# Altium schematic sheet cm_filter_ch0_a.SchDoc: Common Mode Filter CH0 A
size A4; Date: 2015-02-21; Author: Piotr Kuligowski; Revision: 1-0; SheetNumber: 2; SheetTotal: 8; Model: EM1
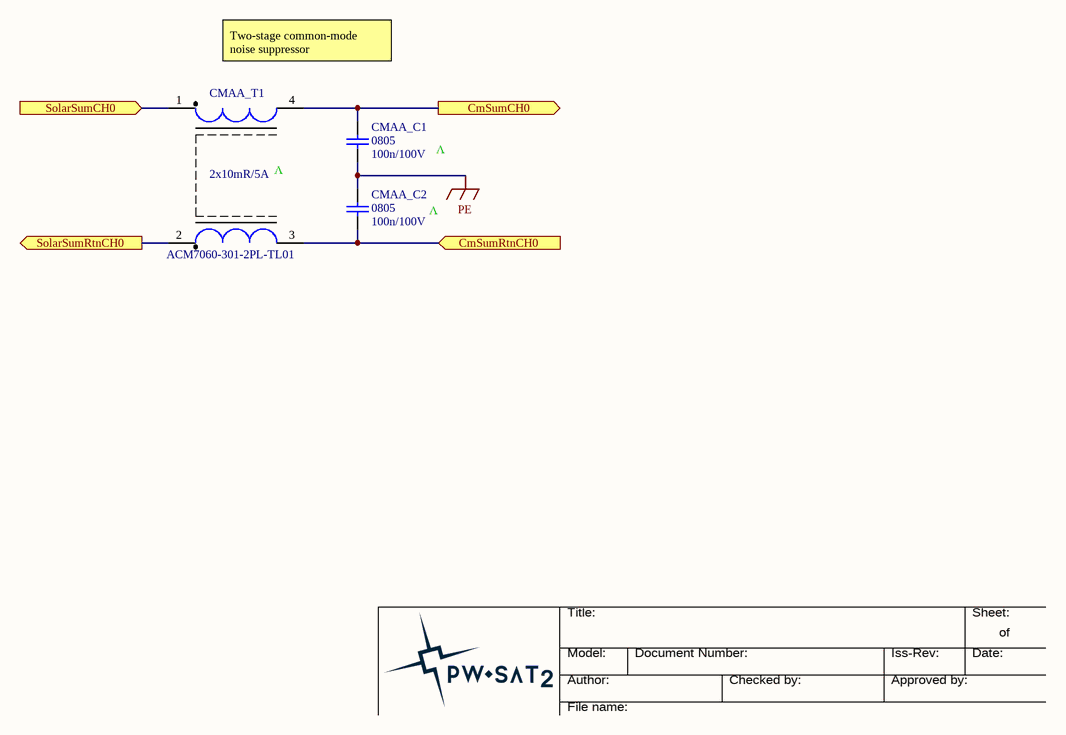
[diagram p0: cm_filter_ch0_a.SchDoc]

## Parts
CMAA_C1  Package: 0805  [SMD_Capacitor_0805]  (hidden comment: 100n/100V)
CMAA_C2  Package: 0805  [SMD_Capacitor_0805]  (hidden comment: 100n/100V)
CMAA_T1  2x10mR/5A  [TDK_ACM7060]

## Ports
CmSumCH0 (out), CmSumRtnCH0 (in), SolarSumCH0 (in), SolarSumRtnCH0 (out)

## Nets
PE: CMAA_C1.2 CMAA_C2.1
CmSumCH0: CMAA_C1.1 CMAA_T1.4 ; port CmSumCH0
CmSumRtnCH0: CMAA_C2.2 CMAA_T1.3 ; port CmSumRtnCH0
SolarSumCH0: CMAA_T1.1 ; port SolarSumCH0
SolarSumRtnCH0: CMAA_T1.2 ; port SolarSumRtnCH0

## Notes on the sheet
- Two-stage common-mode noise suppressor
- (near CMAA_T1) V
- V
- Title:
- Sheet:
- of
- Author:
- Model:
- Document Number:
- Checked by:
- Iss-Rev:
- Approved by:
- Date:
- File name:

## Library data of the parts
CMAA_C1 CMAA_C2 = Cer_C0805T104K1RCLTU: Ceramic Cap Kemet COTS 100n/100V X7R 0805; ManufacturerPartNumber: C0805T104K1RCLTU; Manufacturer: Kemet; Value: 100n/100V
CMAA_T1 = ACM7060-301-2PL-TL01: TDK ACM7060-301 Common Mode Choke; Manufacturer: TDK; ManufacturerPartNumber: ACM7060-301-2PL-TL01; Value: 2x10mR/5A